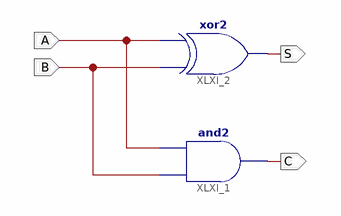
[diagram p0: schematic sheet 1]
// Xilinx ISE schematic HA.sch (spartan3e) as structural Verilog: 2 symbols, 4 ports
module HA (
  input  A,
  input  B,
  output C,
  output S
);

  and XLXI_1 (C, B, A);
  xor XLXI_2 (S, B, A);
endmodule
